# EAGLE design Missing Pulse Detector (EAGLE 6.3)
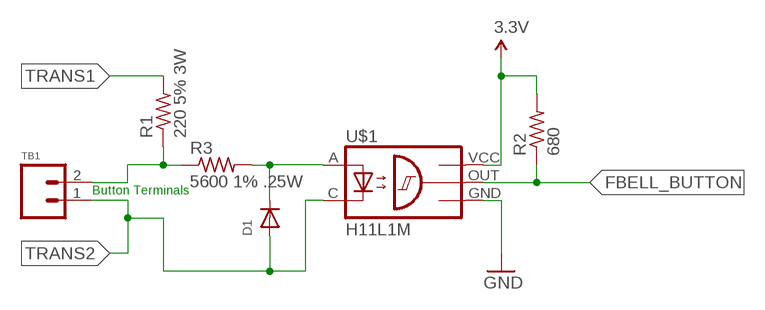
[diagram p0: schematic, sheet 1]

## Parts
D1  DIODE0603  [0603_DIODE]
R1  220 5% 3W  RESISTOR4122  [4122_RESISTOR]
R2  680  RESISTOR0603  [0603_RESISTOR]
R3  5600 1% .25W  RESISTOR1206  [1206_RESISTOR]
TB1  TERMINAL_BLOCK_2  [TERMINAL_BLOCK_2]
U$1  H11L1M  [SOIC6]

## Nets
3.3V: R2.2 U$1.VCC
FBELL_BUTTON: R2.1 U$1.OUT
FDB1: R1.1 R3.1 TB1.2
GND: U$1.GND
N$9: D1.C R3.2 U$1.A
TRANS1: R1.2
TRANS2: D1.A TB1.1 U$1.C

## Notes on the sheet
- Button Terminals

## Library data of the parts
D1 = jkf:DIODE; DIGIKEY#: 641-1002-1-ND
R1 = jkf:RESISTOR; DIGIKEY#: A103620CT-ND
R2 = jkf:RESISTOR; DIGIKEY#: P680GCT-ND
R3 = jkf:RESISTOR; DIGIKEY#: P5.60KFCT-ND
TB1 = jkf:TERMINAL_BLOCK_2; DIGIKEY#: 277-2072-1-ND; MANF: Phoenix; MANF#: 1771091
U$1 = jkf:H11L1M; DIGIKEY#: H11L1SM-ND; MANF: Fairchild Semiconductor; MANF#: H11L1SM

## Board
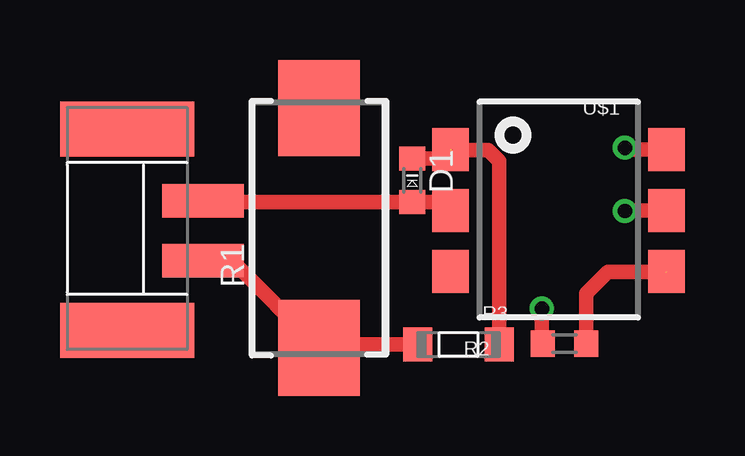
[diagram p1: board, top side]
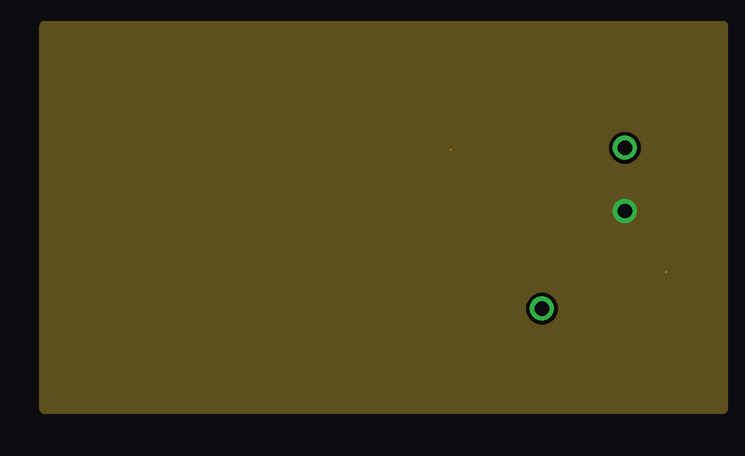
[diagram p2: board, inner layer GND]
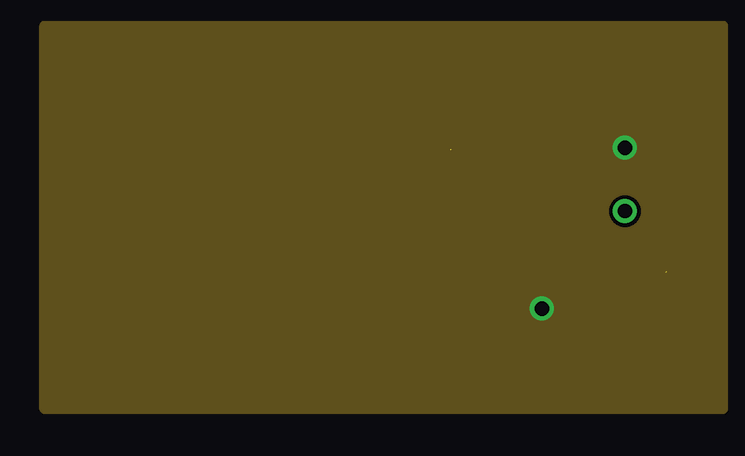
[diagram p3: board, inner layer 3.3V]

No outline drawn. Coordinates in mm, seen from the top.
Copper layers (1+2*15+16): Top 0.0178mm / dielectric 12mil / GND 0.0356mm / dielectric 28mil / 3.3V 0.0356mm / dielectric 12mil / Bottom 0.0178mm
Design rules "SSC-EAGLE-4Lyr_v1.0.0.3": minimum track width 6mil, minimum drill 8mil, track to track 6mil, track to pad 6mil, pad to pad 6mil, via to via 6mil, smd to smd 6mil, copper to edge 20mil, drill to drill 16mil, minimum pad ring 8mil, minimum via ring 8mil, stop-mask expansion 3mil, vias tented up to drill 0mil, thermal gap 10mil

### Footprints (pad centres in the part's own frame; a part is rotated, then mirrored left to right if it is on the bottom)
0603_DIODE = smd 1 x 1.1: A 0.9,0; C -0.9,0
4122_RESISTOR = smd 4 x 3.4: 1 -5,0; 2 5,0
0603_RESISTOR = smd 1 x 1.1: 1 -0.9,0; 2 0.9,0
1206_RESISTOR = smd 1.2 x 1.4: 1 -1.7,0; 2 1.7,0
TERMINAL_BLOCK_2 = smd 1.4 x 3.4: 1 -1.2,3.15; 2 1.3,3.15 | smd 2.3 x 5.6: P$1 -4.2,0; P$2 4.2,0
SOIC6 = smd 1.52 x 1.78: A -4.5,2.55; C -4.5,0.01; GND 4.5,0.01; NC -4.5,-2.53; OUT 4.5,-2.53; VCC 4.5,2.55

### Placement (x,y rotation side)
D1  15.32,9.82 270 top
R1  11.44,7.84 90 top
R2  21.67,3.01 180 top
R3  17.25,2.97 0 top
TB1  3.45,7.76 270 top
U$1  21.42,8.55 0 top

### Tracks (layer width: path | path; a pad name or v marks a point on that pad's centre or on a via)
3.3V  (via drill 0.6)
  Top 0.406: R2.2 20.73,3.01 | 24.18,11.1 v24.18,11.18
  Top 0.61: 20.73,3.01 v20.73,4.47 | U$1.VCC 24.18,11.1
  pour 3.3V: 0,16.27 28.27,16.27 28.27,0.27 0,0.27
FBELL_BUTTON  (1 unrouted)
  Top 0.61: R2.1 22.57,5.09 23.47,5.99 25.9,5.99
FDB1
  Top 0.61: TB1.2 7.82,6.46 R1.1 11.57,2.97 R3.1
GND  (via drill 0.6)
  Top 0.406: 24.18,8.56 v24.18,8.53
  Top 0.61: U$1.GND 24.18,8.56
  pour GND: 0,16.27 28.27,16.27 28.27,0.27 0,0.27
N$9  (1 unrouted)
  Top 0.406: 16.92,10.71 U$1.A
  Top 0.61: R3.2 18.95,10.62 18.49,11.07 16.94,11.07 | D1.C 16.92,10.71
TRANS2
  Top 0.406: 16.92,8.91 U$1.C
  Top 0.61: TB1.1 6.6,8.91 D1.A 16.92,8.91